# Altium schematic sheet fpga-serdes-power.SchDoc
size Tabloid; SheetNumber: 28; SheetTotal: 40
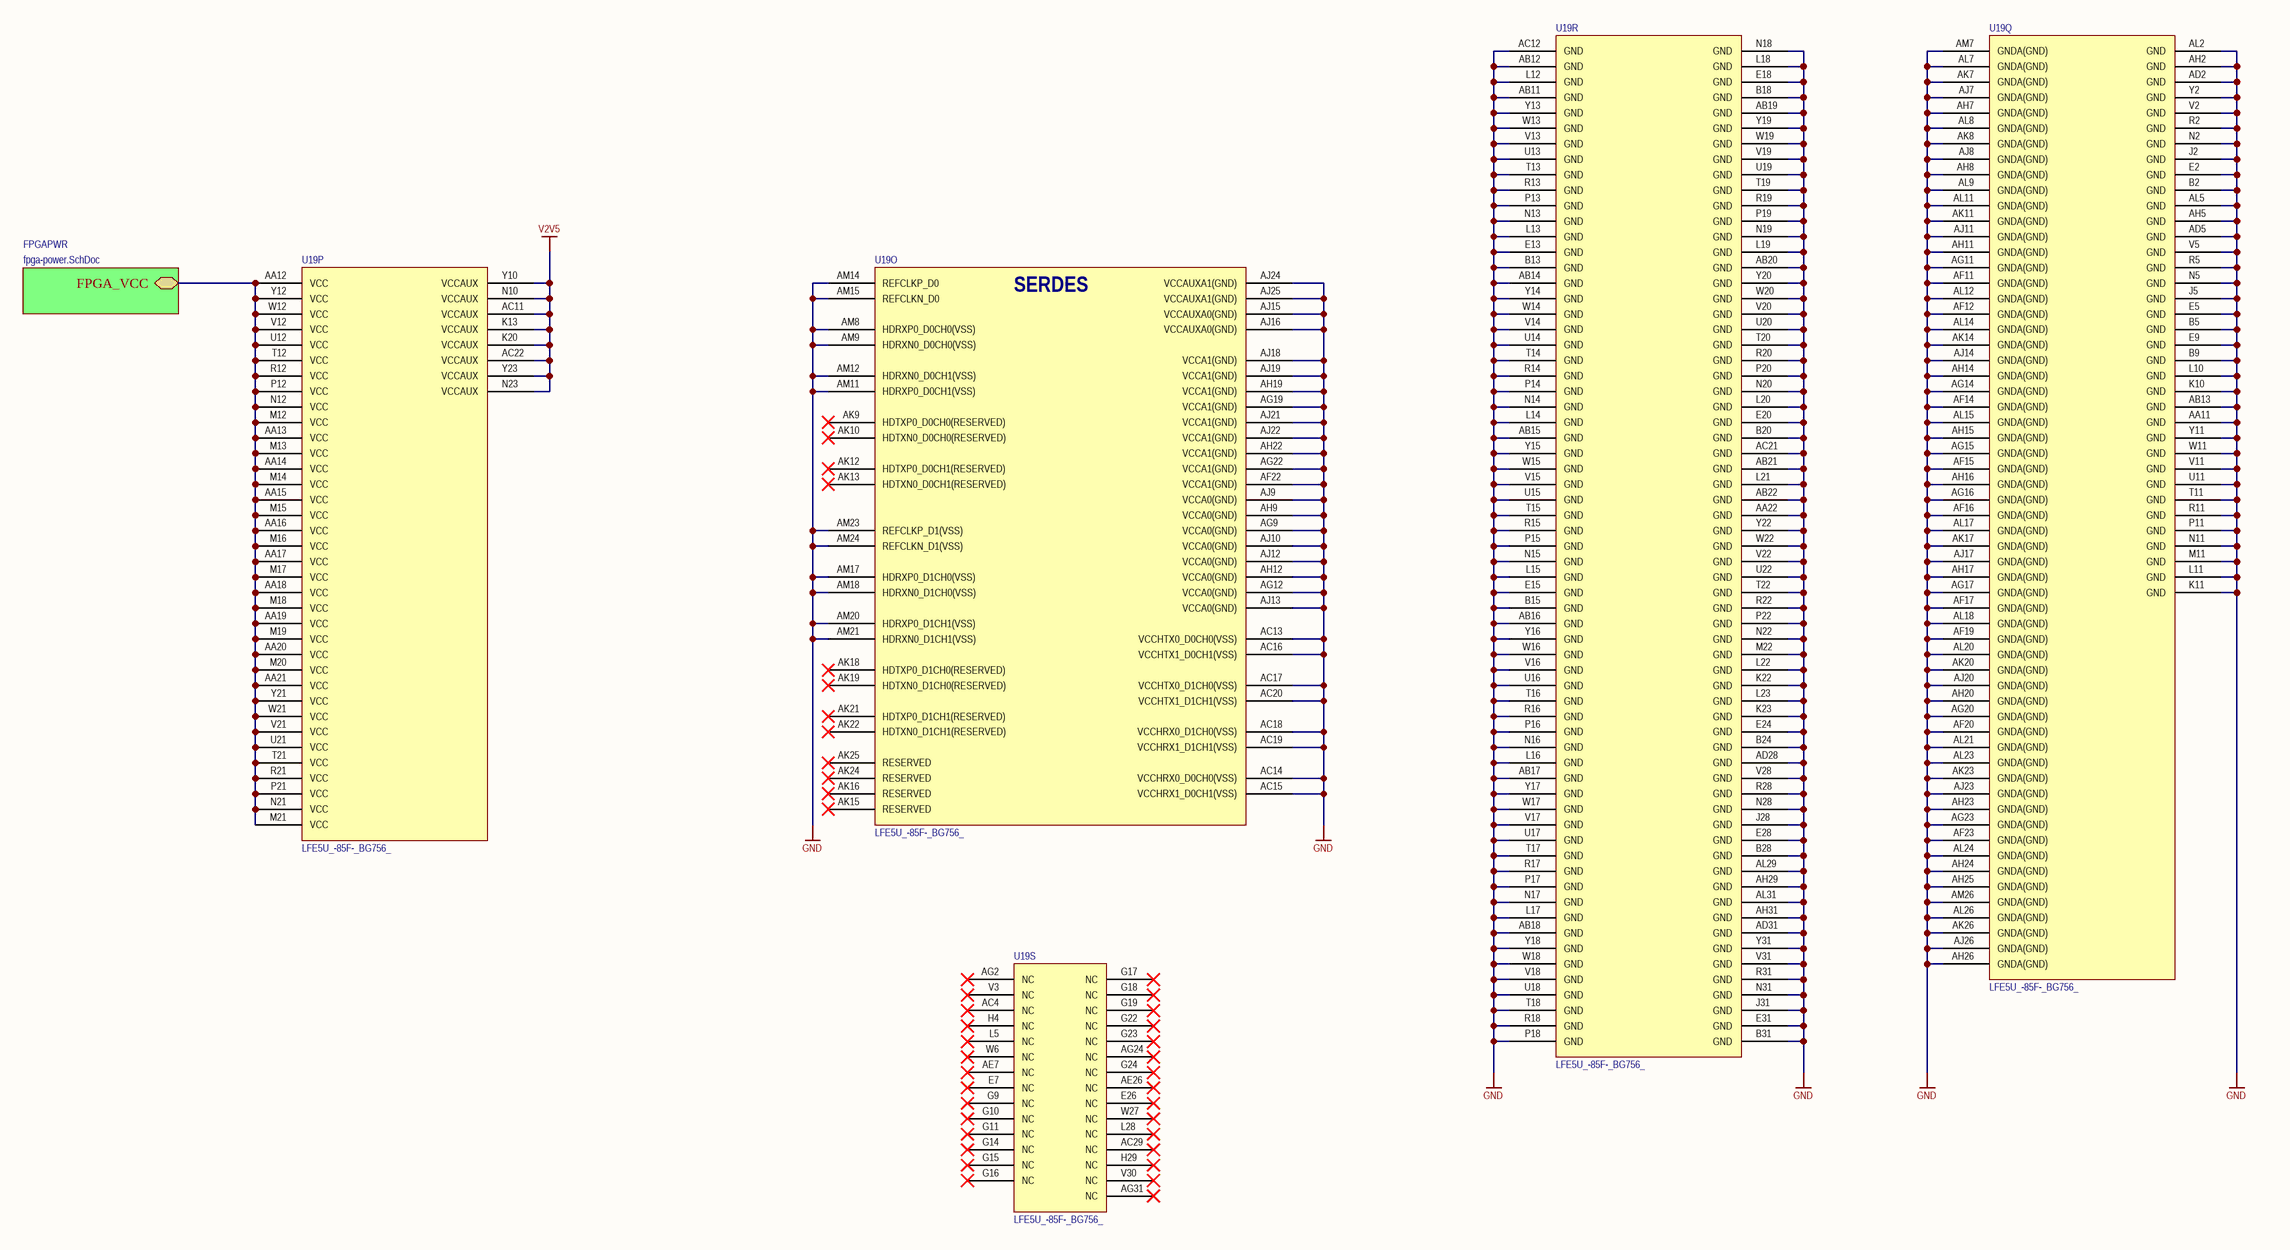
[diagram p0: fpga-serdes-power.SchDoc]

## Parts
U19  LFE5U_-85F-_BG756_  [caBGA756]  (parts O,P,Q,R,S of 19)

## Sub-sheets
FPGAPWR = fpga-power.SchDoc: FPGA_VCC

## Nets
GND: U19.AA11(GND) U19.AA22(GND) U19.AB11(GND) U19.AB12(GND) U19.AB13(GND) U19.AB14(GND) U19.AB15(GND) U19.AB16(GND) U19.AB17(GND) U19.AB18(GND) U19.AB19(GND) U19.AB20(GND) U19.AB21(GND) U19.AB22(GND) U19.AC12(GND) U19.AC13(VCCHTX0_D0CH0(VSS)) U19.AC14(VCCHRX0_D0CH0(VSS)) U19.AC15(VCCHRX1_D0CH1(VSS)) U19.AC16(VCCHTX1_D0CH1(VSS)) U19.AC17(VCCHTX0_D1CH0(VSS)) U19.AC18(VCCHRX0_D1CH0(VSS)) U19.AC19(VCCHRX1_D1CH1(VSS)) U19.AC20(VCCHTX1_D1CH1(VSS)) U19.AC21(GND) U19.AD2(GND) U19.AD5(GND) U19.AD28(GND) U19.AD31(GND) U19.AF11(GNDA(GND)) U19.AF12(GNDA(GND)) U19.AF14(GNDA(GND)) U19.AF15(GNDA(GND)) U19.AF16(GNDA(GND)) U19.AF17(GNDA(GND)) U19.AF19(GNDA(GND)) U19.AF20(GNDA(GND)) U19.AF22(VCCA1(GND)) U19.AF23(GNDA(GND)) U19.AG9(VCCA0(GND)) U19.AG11(GNDA(GND)) U19.AG12(VCCA0(GND)) U19.AG14(GNDA(GND)) U19.AG15(GNDA(GND)) U19.AG16(GNDA(GND)) U19.AG17(GNDA(GND)) U19.AG19(VCCA1(GND)) U19.AG20(GNDA(GND)) U19.AG22(VCCA1(GND)) U19.AG23(GNDA(GND)) U19.AH2(GND) U19.AH5(GND) U19.AH7(GNDA(GND)) U19.AH8(GNDA(GND)) U19.AH9(VCCA0(GND)) U19.AH11(GNDA(GND)) U19.AH12(VCCA0(GND)) U19.AH14(GNDA(GND)) U19.AH15(GNDA(GND)) U19.AH16(GNDA(GND)) U19.AH17(GNDA(GND)) U19.AH19(VCCA1(GND)) U19.AH20(GNDA(GND)) U19.AH22(VCCA1(GND)) U19.AH23(GNDA(GND)) U19.AH24(GNDA(GND)) U19.AH25(GNDA(GND)) U19.AH26(GNDA(GND)) U19.AH29(GND) U19.AH31(GND) U19.AJ7(GNDA(GND)) U19.AJ8(GNDA(GND)) U19.AJ9(VCCA0(GND)) U19.AJ10(VCCA0(GND)) U19.AJ11(GNDA(GND)) U19.AJ12(VCCA0(GND)) U19.AJ13(VCCA0(GND)) U19.AJ14(GNDA(GND)) U19.AJ15(VCCAUXA0(GND)) U19.AJ16(VCCAUXA0(GND)) U19.AJ17(GNDA(GND)) U19.AJ18(VCCA1(GND)) U19.AJ19(VCCA1(GND)) U19.AJ20(GNDA(GND)) U19.AJ21(VCCA1(GND)) U19.AJ22(VCCA1(GND)) U19.AJ23(GNDA(GND)) U19.AJ24(VCCAUXA1(GND)) U19.AJ25(VCCAUXA1(GND)) U19.AJ26(GNDA(GND)) U19.AK7(GNDA(GND)) U19.AK8(GNDA(GND)) U19.AK11(GNDA(GND)) U19.AK14(GNDA(GND)) U19.AK17(GNDA(GND)) U19.AK20(GNDA(GND)) U19.AK23(GNDA(GND)) U19.AK26(GNDA(GND)) U19.AL2(GND) U19.AL5(GND) U19.AL7(GNDA(GND)) U19.AL8(GNDA(GND)) U19.AL9(GNDA(GND)) U19.AL11(GNDA(GND)) U19.AL12(GNDA(GND)) U19.AL14(GNDA(GND)) U19.AL15(GNDA(GND)) U19.AL17(GNDA(GND)) U19.AL18(GNDA(GND)) U19.AL20(GNDA(GND)) U19.AL21(GNDA(GND)) U19.AL23(GNDA(GND)) U19.AL24(GNDA(GND)) U19.AL26(GNDA(GND)) U19.AL29(GND) U19.AL31(GND) U19.AM7(GNDA(GND)) U19.AM8(HDRXP0_D0CH0(VSS)) U19.AM9(HDRXN0_D0CH0(VSS)) U19.AM11(HDRXP0_D0CH1(VSS)) U19.AM12(HDRXN0_D0CH1(VSS)) U19.AM14(REFCLKP_D0) U19.AM15(REFCLKN_D0) U19.AM17(HDRXP0_D1CH0(VSS)) U19.AM18(HDRXN0_D1CH0(VSS)) U19.AM20(HDRXP0_D1CH1(VSS)) U19.AM21(HDRXN0_D1CH1(VSS)) U19.AM23(REFCLKP_D1(VSS)) U19.AM24(REFCLKN_D1(VSS)) U19.AM26(GNDA(GND)) U19.B2(GND) U19.B5(GND) U19.B9(GND) U19.B13(GND) U19.B15(GND) U19.B18(GND) U19.B20(GND) U19.B24(GND) U19.B28(GND) U19.B31(GND) U19.E2(GND) U19.E5(GND) U19.E9(GND) U19.E13(GND) U19.E15(GND) U19.E18(GND) U19.E20(GND) U19.E24(GND) U19.E28(GND) U19.E31(GND) U19.J2(GND) U19.J5(GND) U19.J28(GND) U19.J31(GND) U19.K10(GND) U19.K11(GND) U19.K22(GND) U19.K23(GND) U19.L10(GND) U19.L11(GND) U19.L12(GND) U19.L13(GND) U19.L14(GND) U19.L15(GND) U19.L16(GND) U19.L17(GND) U19.L18(GND) U19.L19(GND) U19.L20(GND) U19.L21(GND) U19.L22(GND) U19.L23(GND) U19.M11(GND) U19.M22(GND) U19.N2(GND) U19.N5(GND) U19.N11(GND) U19.N13(GND) U19.N14(GND) U19.N15(GND) U19.N16(GND) U19.N17(GND) U19.N18(GND) U19.N19(GND) U19.N20(GND) U19.N22(GND) U19.N28(GND) U19.N31(GND) U19.P11(GND) U19.P13(GND) U19.P14(GND) U19.P15(GND) U19.P16(GND) U19.P17(GND) U19.P18(GND) U19.P19(GND) U19.P20(GND) U19.P22(GND) U19.R2(GND) U19.R5(GND) U19.R11(GND) U19.R13(GND) U19.R14(GND) U19.R15(GND) U19.R16(GND) U19.R17(GND) U19.R18(GND) U19.R19(GND) U19.R20(GND) U19.R22(GND) U19.R28(GND) U19.R31(GND) U19.T11(GND) U19.T13(GND) U19.T14(GND) U19.T15(GND) U19.T16(GND) U19.T17(GND) U19.T18(GND) U19.T19(GND) U19.T20(GND) U19.T22(GND) U19.U11(GND) U19.U13(GND) U19.U14(GND) U19.U15(GND) U19.U16(GND) U19.U17(GND) U19.U18(GND) U19.U19(GND) U19.U20(GND) U19.U22(GND) U19.V2(GND) U19.V5(GND) U19.V11(GND) U19.V13(GND) U19.V14(GND) U19.V15(GND) U19.V16(GND) U19.V17(GND) U19.V18(GND) U19.V19(GND) U19.V20(GND) U19.V22(GND) U19.V28(GND) U19.V31(GND) U19.W11(GND) U19.W13(GND) U19.W14(GND) U19.W15(GND) U19.W16(GND) U19.W17(GND) U19.W18(GND) U19.W19(GND) U19.W20(GND) U19.W22(GND) U19.Y2(GND) U19.Y11(GND) U19.Y13(GND) U19.Y14(GND) U19.Y15(GND) U19.Y16(GND) U19.Y17(GND) U19.Y18(GND) U19.Y19(GND) U19.Y20(GND) U19.Y22(GND) U19.Y31(GND)
V2V5: U19.AC11(VCCAUX) U19.AC22(VCCAUX) U19.K13(VCCAUX) U19.K20(VCCAUX) U19.N10(VCCAUX) U19.N23(VCCAUX) U19.Y10(VCCAUX) U19.Y23(VCCAUX)
NetU19_AA12: U19.AA12(VCC) U19.AA13(VCC) U19.AA14(VCC) U19.AA15(VCC) U19.AA16(VCC) U19.AA17(VCC) U19.AA18(VCC) U19.AA19(VCC) U19.AA20(VCC) U19.AA21(VCC) U19.M12(VCC) U19.M13(VCC) U19.M14(VCC) U19.M15(VCC) U19.M16(VCC) U19.M17(VCC) U19.M18(VCC) U19.M19(VCC) U19.M20(VCC) U19.M21(VCC) U19.N12(VCC) U19.N21(VCC) U19.P12(VCC) U19.P21(VCC) U19.R12(VCC) U19.R21(VCC) U19.T12(VCC) U19.T21(VCC) U19.U12(VCC) U19.U21(VCC) U19.V12(VCC) U19.V21(VCC) U19.W12(VCC) U19.W21(VCC) U19.Y12(VCC) U19.Y21(VCC) ; sheet FPGAPWR/FPGA_VCC

Not connected (* = marked no-connect by the designer): U19 AC4(NC)* AC29(NC)* AE7(NC)* AE26(NC)* AG2(NC)* AG24(NC)* AG31(NC)* AK9(HDTXP0_D0CH0(RESERVED))* AK10(HDTXN0_D0CH0(RESERVED))* AK12(HDTXP0_D0CH1(RESERVED))* AK13(HDTXN0_D0CH1(RESERVED))* AK15(RESERVED)* AK16(RESERVED)* AK18(HDTXP0_D1CH0(RESERVED))* AK19(HDTXN0_D1CH0(RESERVED))* AK21(HDTXP0_D1CH1(RESERVED))* AK22(HDTXN0_D1CH1(RESERVED))* AK24(RESERVED)* AK25(RESERVED)* E7(NC)* E26(NC)* G9(NC)* G10(NC)* G11(NC)* G14(NC)* G15(NC)* G16(NC)* G17(NC)* G18(NC)* G19(NC)* G22(NC)* G23(NC)* G24(NC)* H4(NC)* H29(NC)* L5(NC)* L28(NC)* V3(NC)* V30(NC)* W6(NC)* W27(NC)*

## Notes on the sheet
- (in symbol LFE5U_-85F-_BG756_, part O) SERDES

## Library data of the parts
U19 = LFE5U_-85F-_BG756_: ECP5 FPGA, 85k LUT, 756-caBGA; Manufacturer: Lattice Semiconductor; Manufacturer P/N: LFE5U_-85F-_BG756_